# EAGLE design MIDI Signal Contidioner (EAGLE 9.3.0)
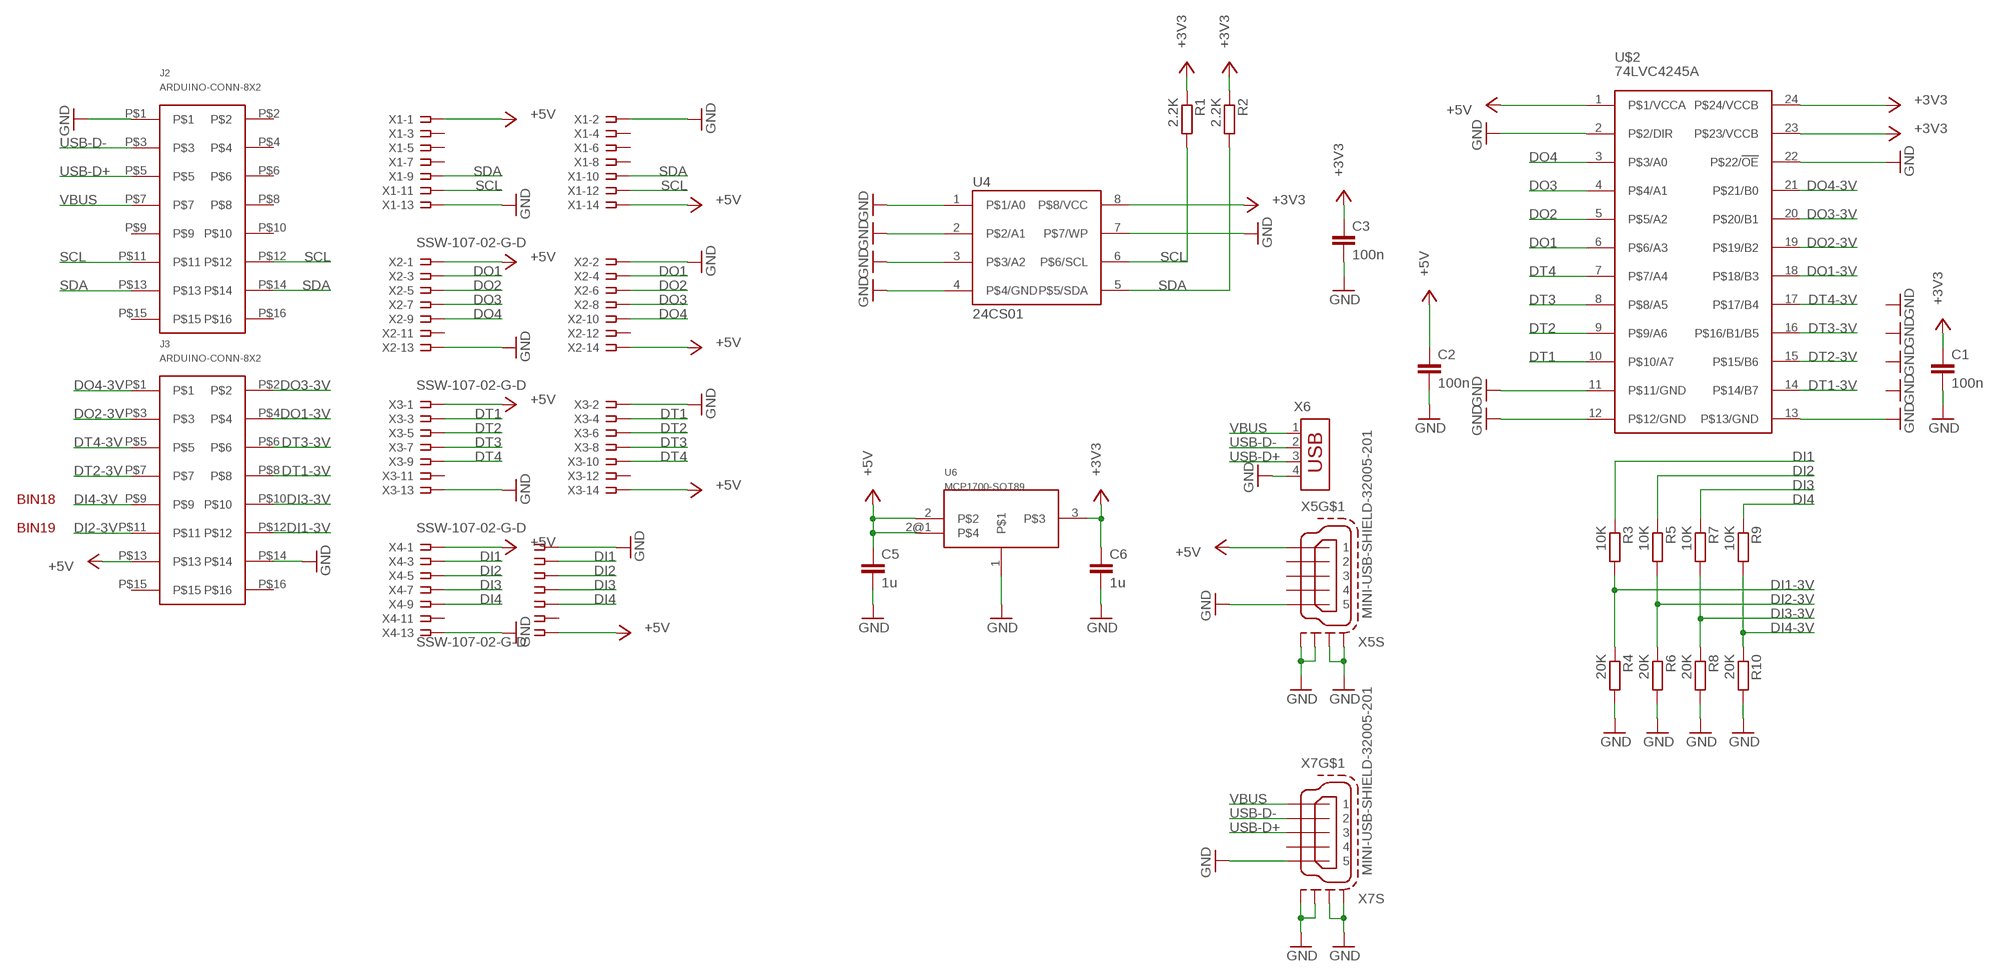
[diagram p0: schematic, sheet 1]

## Parts
C1  100n  C-EUC0805  [C0805]
C2  100n  C-EUC0805  [C0805]
C3  100n  C-EUC0805  [C0805]
C5  1u  C-EUC0805  [C0805]
C6  1u  C-EUC0805  [C0805]
J2  ARDUINO-CONN-8X2  [ARDUINO-CONN-8X2]
J3  ARDUINO-CONN-8X2  [ARDUINO-CONN-8X2]
R1  2.2K  R-EU_R0805W  [R0805W]
R2  2.2K  R-EU_R0805W  [R0805W]
R3  10K  R-EU_R0805W  [R0805W]
R4  20K  R-EU_R0805W  [R0805W]
R5  10K  R-EU_R0805W  [R0805W]
R6  20K  R-EU_R0805W  [R0805W]
R7  10K  R-EU_R0805W  [R0805W]
R8  20K  R-EU_R0805W  [R0805W]
R9  10K  R-EU_R0805W  [R0805W]
R10  20K  R-EU_R0805W  [R0805W]
U4  24CS01  [24CS01-SO8]
U6  MCP1700-SOT89  [MCP1700-SOT89]
U$2  74LVC4245A  [74LVC4245A-SO24]
X1  SSW-107-02-G-D  [SSW-107-02-G-D]
X2  SSW-107-02-G-D  [SSW-107-02-G-D]
X3  SSW-107-02-G-D  [SSW-107-02-G-D]
X4  SSW-107-02-G-D  [SSW-107-02-G-D]
X5  MINI-USB-SHIELD-32005-201  [MINI-USB-32005-201]
X6  USB-787616  [USB]
X7  MINI-USB-SHIELD-32005-201  [MINI-USB-32005-201]

## Nets
+3V3: C1.1 C3.1 C6.1 R1.1 R2.1 U4.8(P$8/VCC) U6.3 U$2.23(P$23/VCCB) U$2.24(P$24/VCCB)
+5V: C2.1 C5.1 J3.P$13 U6.2 U6.2@1 U$2.1(P$1/VCCA) X1.1 X1.14 X2.1 X2.14 X3.1 X3.14 X4.1 X4.14 X5.1
DI1: R3.1 X4.3 X4.4
DI1-3V: J3.P$12 R3.2 R4.1
DI2: R5.1 X4.5 X4.6
DI2-3V: J3.P$11 R5.2 R6.1
DI3: R7.1 X4.7 X4.8
DI3-3V: J3.P$10 R7.2 R8.1
DI4: R9.1 X4.9 X4.10
DI4-3V: J3.P$9 R9.2 R10.1
DO1: U$2.6(P$6/A3) X2.3 X2.4
DO1-3V: J3.P$4 U$2.18(P$18/B3)
DO2: U$2.5(P$5/A2) X2.5 X2.6
DO2-3V: J3.P$3 U$2.19(P$19/B2)
DO3: U$2.4(P$4/A1) X2.7 X2.8
DO3-3V: J3.P$2 U$2.20(P$20/B1)
DO4: U$2.3(P$3/A0) X2.9 X2.10
DO4-3V: J3.P$1 U$2.21(P$21/B0)
DT1: U$2.10(P$10/A7) X3.3 X3.4
DT1-3V: J3.P$8 U$2.14(P$14/B7)
DT2: U$2.9(P$9/A6) X3.5 X3.6
DT2-3V: J3.P$7 U$2.15(P$15/B6)
DT3: U$2.8(P$8/A5) X3.7 X3.8
DT3-3V: J3.P$6 U$2.16(P$16/B1/B5)
DT4: U$2.7(P$7/A4) X3.9 X3.10
DT4-3V: J3.P$5 U$2.17(P$17/B4)
GND: C1.2 C2.2 C3.2 C5.2 C6.2 J2.P$1 J3.P$14 R4.2 R6.2 R8.2 R10.2 U4.1(P$1/A0) U4.2(P$2/A1) U4.3(P$3/A2) U4.4(P$4/GND) U4.7(P$7/WP) U6.1 U$2.2(P$2/DIR) U$2.11(P$11/GND) U$2.12(P$12/GND) U$2.13(P$13/GND) U$2.22(P$22/!OE) X1.2 X1.13 X2.2 X2.13 X3.2 X3.13 X4.2 X4.13 X5.5 X5.M1(S:S1) X5.M2(S:S2) X5.M3(S:S3) X5.M4(S:S4) X6.4 X7.5 X7.M1(S:S1) X7.M2(S:S2) X7.M3(S:S3) X7.M4(S:S4)
SCL: J2.P$11 J2.P$12 R1.2 U4.6(P$6/SCL) X1.11 X1.12
SDA: J2.P$13 J2.P$14 R2.2 U4.5(P$5/SDA) X1.9 X1.10
USB-D+: J2.P$5 X6.3 X7.3
USB-D-: J2.P$3 X6.2 X7.2
VBUS: J2.P$7 X6.1 X7.1
Unconnected: J2.P$2 J2.P$4 J2.P$6 J2.P$8 J2.P$9 J2.P$10 J2.P$15 J2.P$16 J3.P$15 J3.P$16 X1.3 X1.4 X1.5 X1.6 X1.7 X1.8 X2.11 X2.12 X3.11 X3.12 X4.11 X4.12 X5.2 X5.3 X5.4 X7.4

## Notes on the sheet
- BIN18
- BIN19

## Library data of the parts
C1-C3 C5 C6 = rcl:C-EU: CAPACITOR, European symbol; SPICEPREFIX: C
J2 J3 = MIDI router MCU parts:ARDUINO-CONN-8X2
R1-R10 = rcl:R-EU_: RESISTOR, European symbol; SPICEPREFIX: R
U4 = MIDI Signal Conditioner Parts:24CS01
U6 = MIDI router parts:MCP1700-SOT89
U$2 = MIDI router parts:74LVC4245A
X1-X4 = MIDI router parts:SSW-107-02-G: THROUGH-HOLE .025" SQ POST SOCKET Source: Samtec SSW.pdf; MF: Samtec Inc.; MPN: SSW-107-02-G-D; OC_FARNELL: unknown; OC_NEWARK: 11P9431
X5 X7 = MIDI router parts:MINI-USB-SHIELD-: MINI USB-B Conector Source: www.cypressindustries.com; OC_FARNELL: unknown; OC_NEWARK: unknown
X6 = MIDI router parts:USB-787616: AMP connector

## Board
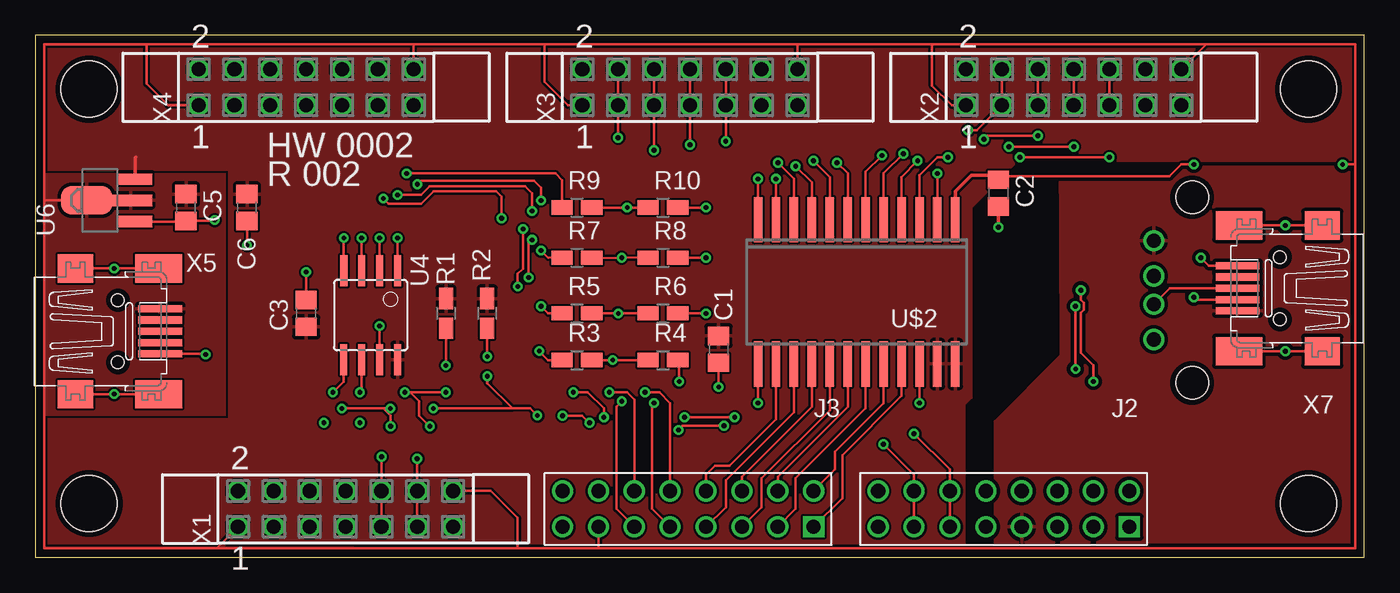
[diagram p1: board, top side]
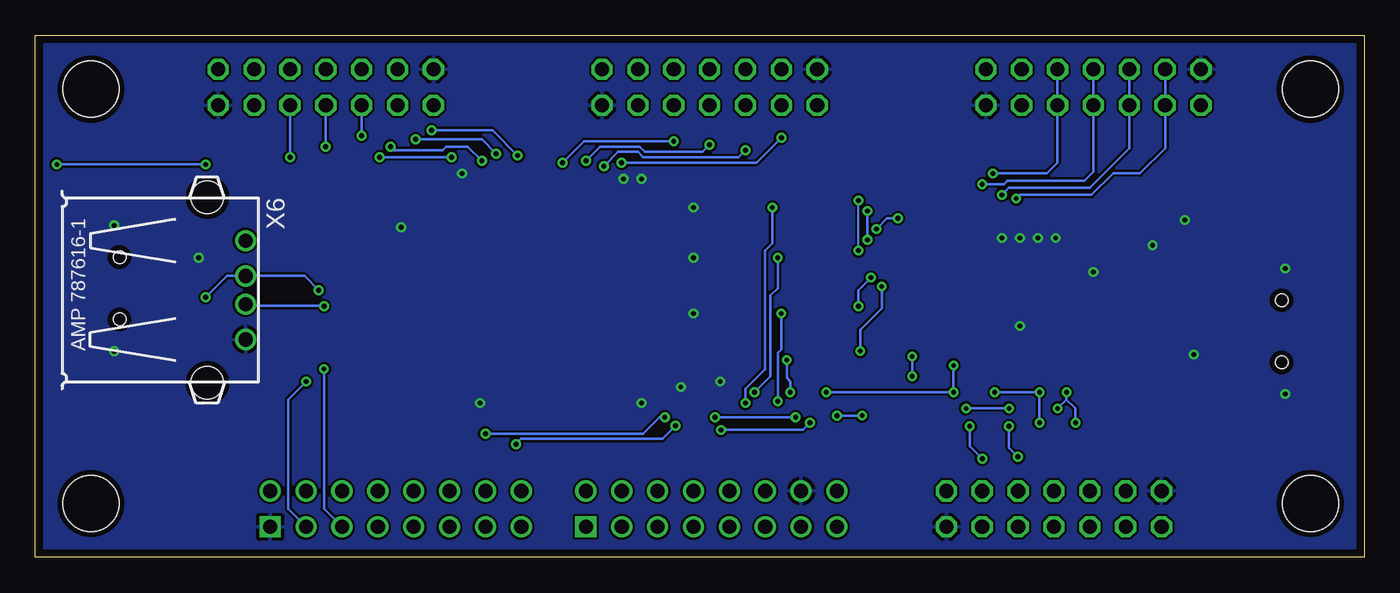
[diagram p2: board, bottom side, seen from below]

Size 94.11 x 36.96 mm. Coordinates in mm from the lower left corner, seen from the top.
Outline: 0,0 94.11,0 94.11,36.96 0,36.96 0,0
Copper layers (1*16): Top 0.0356mm / dielectric 1.5011mm / Bottom 0.0356mm
Design rules "LaenPCBOrder": minimum track width 6mil, minimum drill 13mil, track to track 6mil, track to pad 6mil, pad to pad 6mil, via to via 6mil, smd to smd 6mil, copper to edge 15mil, drill to drill 6mil, minimum pad ring 7mil, minimum via ring 7mil, stop-mask expansion 3mil, vias tented up to drill 0mil, thermal gap 10mil
Holes 3.96 mm at 3.81,33.15 3.81,3.81 90.17,3.81 90.17,33.15

### Footprints (pad centres in the part's own frame; a part is rotated, then mirrored left to right if it is on the bottom)
C0805 = smd 1.3 x 1.5: 1 -0.95,0; 2 0.95,0
ARDUINO-CONN-8X2 = drill 1 square: P$1 0,0 | drill 1: P$2 0,-2.54; P$3 2.54,0; P$4 2.54,-2.54; P$5 5.08,0; P$6 5.08,-2.54; P$7 7.62,0; P$8 7.62,-2.54; P$9 10.16,0; P$10 10.16,-2.54; P$11 12.7,0; P$12 12.7,-2.54; P$13 15.24,0; P$14 15.24,-2.54; P$15 17.78,0; P$16 17.78,-2.54
R0805W = smd 1.5 x 1: 1 -1.052,0; 2 1.052,0
24CS01-SO8 = smd 0.5 x 2.2: 1 -1.905,-3.154; 2 -0.645,-3.154; 3 0.625,-3.154; 4 1.895,-3.154; 5 1.905,3.154; 6 0.635,3.154; 7 -0.635,3.154; 8 -1.905,3.154
MCP1700-SOT89 = smd 0.8 x 2.4: 1 -1.499,-2.5; 3 1.499,-2.5 | smd 0.8 x 3: 2 0,-2.2 | smd 2.032 x 3.65: 2@1 0,0.94
74LVC4245A-SO24 = smd 0.6 x 3.2: 1 -8.255,-5.1; 2 -6.985,-5.1; 3 -5.715,-5.1; 4 -4.445,-5.1; 5 -3.175,-5.1; 6 -1.905,-5.1; 7 -0.635,-5.1; 8 0.635,-5.1; 9 1.905,-5.1; 10 3.175,-5.1; 11 4.445,-5.1; 12 5.715,-5.1; 13 5.715,5.1; 14 4.445,5.1; 15 3.175,5.1; 16 1.905,5.1; 17 0.635,5.1; 18 -0.635,5.1; 19 -1.905,5.1; 20 -3.175,5.1; 21 -4.445,5.1; 22 -5.715,5.1; 23 -6.985,5.1; 24 -8.255,5.1
SSW-107-02-G-D = drill 1 pad 1.5 octagon: 1 -7.62,-1.27; 2 -7.62,1.27; 3 -5.08,-1.27; 4 -5.08,1.27; 5 -2.54,-1.27; 6 -2.54,1.27; 7 0,-1.27; 8 0,1.27; 9 2.54,-1.27; 10 2.54,1.27; 11 5.08,-1.27; 12 5.08,1.27; 13 7.62,-1.27; 14 7.62,1.27
MINI-USB-32005-201 = smd 3.1 x 0.5: 1 3,1.6; 2 3,0.8; 3 3,0; 4 3,-0.8; 5 3,-1.6 | smd 2.5 x 2: M1 -3,-4.45; M2 -3,4.45 | smd 3.3 x 2: M3 2.9,4.45; M4 2.9,-4.45 | hole 0.9: 0,2.2; 0,-2.2
USB = drill 1: 1 -3.5,12.99; 2 -1,12.99; 3 1,12.99; 4 3.5,12.99 | hole 2.3: -6.57,10.28; 6.57,10.28

### Placement (x,y rotation side)
C1  48.39,14.73 270 top
C2  68.2,25.78 270 top
C3  19.18,17.27 90 top
C5  10.67,24.77 270 top
C6  14.99,24.77 270 top
J2  77.47,2.16 180 top
J3  55.12,2.16 180 top
R1  29.08,17.27 270 top
R2  32,17.27 270 top
R3  38.35,13.97 0 top
R4  44.45,13.97 0 top
R5  38.35,17.27 0 top
R6  44.45,17.27 0 top
R7  38.35,21.21 0 top
R8  44.45,21.21 0 top
R9  38.35,24.77 0 top
R10  44.45,24.77 0 top
U4  23.75,17.14 180 top
U6  4.57,25.27 90 top
U$2  56.9,18.8 180 top
X1  21.97,3.43 0 top
X2  73.53,33.27 0 top
X3  46.35,33.27 0 top
X4  19.18,33.27 0 top
X5  5.84,16 0 top
X6  92.2,18.92 270 bottom
X7  88.14,19.05 180 top

### Tracks (layer width: path | path; a pad name or v marks a point on that pad's centre or on a via)
+3V3
  Top 0.254: U6.3 7.07,28.28 7.11,28.32
  pour Top: 65.79,0.64 65.79,10.79 66.29,11.3 66.29,24.77 69.6,28.07 93.47,28.07 93.47,36.32 0.64,36.32 0.64,27.43 13.72,27.43 13.72,9.78 0.64,9.78 0.64,0.64
+5V  (via drill 0.33)
  Top 0.178: J3.P$13 39.88,0.64 | 12.83,0.64 0.64,0.64 0.64,25.27 | 0.64,25.27 0.64,36.32 7.87,36.32 | 53.98,36.32 63.5,36.32 | 63.5,36.32 82.93,36.32 | 93.47,27.81 93.47,36.32 82.93,36.32 | 93.47,27.81 93.47,0.64 39.88,0.64 | U6.2@1 0.64,25.27 | X3.14 53.98,36.32 | 7.87,36.32 7.87,33.53 9.4,32 X4.1 | X1.1 12.83,0.64 | X2.14 82.93,36.32 | C2.1 68.23,26.76 68.45,26.98 80.33,26.98 81.15,27.81 v82.04,27.81 | v92.58,27.81 93.47,27.81 | X3.1 37.72,32 36.07,33.66 36.07,36.32 | 36.07,36.32 26.8,36.32 | 26.8,36.32 7.87,36.32 | 36.07,36.32 53.98,36.32 | X4.14 26.8,36.32 | X2.1 64.9,32 63.5,33.4 63.5,36.32 | 39.88,0.64 34.16,0.64 | 34.16,0.64 12.83,0.64 | X1.14 32.26,4.7 34.16,2.79 34.16,0.64
  Top 0.254: U$2.1 65.15,25.91 66.29,27.05 67.94,27.05 68.23,26.76
  Bottom 0.178: v92.58,27.81 v82.04,27.81
  pour Top (rank 2): 0.64,36.32 22.48,36.32 22.48,0.64 0.64,0.64
DI1  (via drill 0.33)
  Top 0.178: v24.64,25.4 25.02,25.02 27.3,25.02 28.19,25.91 32.64,25.91 33.02,25.53 v33.02,24 | R3.1 36.32,13.97 v35.69,14.61 | v34.16,19.18 34.16,20.07 34.54,20.45 v34.54,23.24
  Bottom 0.178: v24.64,25.4 24.38,25.65 19.3,25.65 17.78,27.18 15.88,27.18 14.1,28.96 X4.3 X4.4 | v35.69,14.61 35.69,16.13 34.16,17.65 v34.16,19.18 | v34.54,23.24 33.78,24 v33.02,24
DI1-3V  (via drill 0.33)
  Top 0.178: R3.2 v40.89,13.97 R4.1 | v40.64,11.68 41.91,11.68 42.42,11.18 J3.P$12
  Bottom 0.178: v40.64,11.68 40.64,12.45 40.89,12.7 v40.89,13.97
DI2  (via drill 0.33)
  Top 0.178: v25.65,25.65 27.3,25.65 27.94,26.29 34.67,26.29 35.18,25.78 v35.18,24.51 | R5.1 36.32,17.27 v35.81,17.78 | v34.92,19.81 34.92,22.23 v35.18,22.48
  Bottom 0.178: v25.65,25.65 25.15,26.16 19.43,26.16 16.64,28.96 X4.5 X4.6 | v35.81,17.78 35.81,18.92 v34.92,19.81 | v35.18,22.48 v35.18,24.51
DI2-3V  (via drill 0.33)
  Top 0.178: R5.2 v41.27,17.27 R6.1 | J3.P$11 41.15,3.43 41.15,10.67 v41.53,11.05
  Bottom 0.178: v41.53,11.05 41.53,14.48 41.27,14.73 v41.27,17.27
DI3  (via drill 0.33)
  Top 0.152: R7.1 36.32,21.21 v35.81,21.72
  Top 0.178: v27.05,26.42 27.3,26.67 35.31,26.67 35.81,26.16 v35.81,25.27
  Bottom 0.152: v35.81,21.72 v35.81,25.27
  Bottom 0.178: v27.05,26.42 25.53,26.42 25.27,26.67 19.81,26.67 19.18,27.3 X4.7 X4.8
DI3-3V  (via drill 0.33)
  Top 0.152: R7.2 v41.53,21.21 R8.1
  Top 0.178: v43.18,11.68 44.2,11.68 44.96,10.92 J3.P$10
  Bottom 0.178: v43.18,11.68 42.04,12.83 42.04,18.54 41.53,19.05 v41.53,21.21
DI4  (via drill 0.33)
  Top 0.178: v26.29,27.18 36.83,27.18 37.3,26.71 R9.1
  Bottom 0.178: v26.29,27.18 22.48,27.18 21.72,27.94 X4.9 X4.10
DI4-3V  (via drill 0.33)
  Top 0.178: R9.2 v41.91,24.77 R10.1 | J3.P$9 43.69,3.43 43.69,10.79 v43.81,10.92
  Bottom 0.178: v43.81,10.92 43.81,11.94 42.42,13.34 42.42,21.72 41.91,22.23 v41.91,24.77
DO1  (via drill 0.35)
  Top 0.178: X2.4 X2.3 66.67,30.23 v66.04,30.23 | U$2.6 58.8,27.3 v59.94,28.45
  Bottom 0.178: v59.94,28.45 61.72,30.23 v66.04,30.23
DO1-3V
  Top 0.178: J3.P$4 52.58,5.71 57.53,10.67 U$2.18
DO2  (via drill 0.35)
  Top 0.178: X2.6 X2.5 | U$2.5 60.07,27.18 v61.47,28.57 | v67.18,29.59 67.44,29.84 v70.99,29.84
  Bottom 0.178: v61.47,28.57 62.48,29.59 v67.18,29.59 | v70.99,29.84 X2.5
DO2-3V
  Top 0.178: J3.P$3 53.85,3.43 53.85,5.59 58.8,10.54 U$2.19
DO3  (via drill 0.35)
  Top 0.178: X2.8 X2.7 | U$2.4 61.34,26.92 v62.48,28.07 | v68.96,29.08 v73.53,29.08
  Bottom 0.178: v62.48,28.07 63.5,29.08 65.02,29.08 65.28,28.83 68.71,28.83 v68.96,29.08 | v73.53,29.08 X2.7
DO3-3V
  Top 0.178: J3.P$2 56.64,6.22 56.64,7.49 60.07,10.92 U$2.20
DO4  (via drill 0.35)
  Top 0.178: X2.10 X2.9 | U$2.3 62.61,27.05 63.88,28.32 v64.64,28.32 | v69.72,28.32 v76.07,28.32
  Bottom 0.178: v64.64,28.32 v69.72,28.32 | v76.07,28.32 X2.9
DO4-3V
  Top 0.178: J3.P$1 57.15,4.19 57.15,7.24 61.34,11.43 U$2.21
DT1  (via drill 0.35)
  Top 0.178: X3.4 X3.3 v41.27,29.72 | U$2.10 53.72,26.8 v52.58,27.94
  Bottom 0.178: v52.58,27.94 43.05,27.94 v41.27,29.72
DT1-3V
  Top 0.178: J3.P$8 47.5,5.84 48.13,6.48 49.15,6.48 52.45,9.78 U$2.14
DT2  (via drill 0.35)
  Top 0.178: X3.6 X3.5 v43.81,28.83 | U$2.9 54.99,26.54 v53.85,27.69
  Bottom 0.178: v53.85,27.69 52.83,28.7 51.44,28.7 51.05,28.32 44.32,28.32 v43.81,28.83
DT2-3V
  Top 0.178: J3.P$7 48.9,3.56 48.9,5.46 53.72,10.29 U$2.15
DT3  (via drill 0.35)
  Top 0.178: X3.8 X3.7 v46.35,29.21 | U$2.8 56.26,26.92 v55.12,28.07
  Bottom 0.178: v55.12,28.07 54.1,29.08 51.31,29.08 50.93,28.7 46.86,28.7 v46.35,29.21
DT3-3V
  Top 0.178: J3.P$6 50.04,5.71 54.99,10.67 U$2.16
DT4  (via drill 0.35)
  Top 0.178: X3.10 X3.9 v48.9,29.46 | U$2.7 57.53,27.18 v56.77,27.94
  Bottom 0.178: v56.77,27.94 55.24,29.46 v48.9,29.46
DT4-3V
  Top 0.178: J3.P$5 51.44,3.56 51.44,5.59 56.26,10.41 U$2.17
GND  (via drill 0.33, 0.35)
  Top 0.152: R4.2 45.59,13.88
  Top 0.178: X5.M1 v5.58,11.55 v5.59,11.56 X5.M4 | X5.M2 v5.58,20.45 | v5.58,20.45 v5.59,20.45 | X5.M3 v5.58,20.45 | U6.1 10.63,23.77 C5.2 12.64,23.82 v12.7,23.88 | X5.5 12.01,14.4 v12.06,14.35 | C3.2 v19.18,20.19 | U4.7 v24.38,16.38 | C6.2 v14.99,22.1 | 45.59,13.88 v45.59,12.45 | C1.2 v48.39,12.06 | R6.2 v47.5,17.27 | R8.2 v47.5,21.21 | R10.2 v47.5,24.77 | U$2.12 v51.18,26.8 | U$2.11 v52.45,26.8 | U$2.2 v63.88,27.18 | U4.4 v21.84,22.61 | U4.3 23.12,22.6 v23.11,22.61 | U4.2 24.39,22.6 v24.38,22.61 | U4.1 v25.65,22.61 | U$2.13 v51.18,10.92 | U$2.22 v62.61,10.92 | X7.M3 v88.51,14.6 v88.52,14.61 v88.52,14.6 X7.M2 | X7.M4 v88.51,23.5 v88.52,23.5 X7.M1 | X7.5 83.11,20.65 v82.55,21.21
  Top 0.254: C2.2 v68.2,23.37
  pour Bottom: 0.64,36.32 93.47,36.32 93.47,0.64 0.64,0.64
SCL  (via drill 0.33, 0.35)
  Top 0.178: U4.6 23.11,11.81 v22.99,11.68 | v29.08,11.68 v26.16,11.68 26.54,11.68 27.18,11.05 27.18,10.03 v27.94,9.27 | R1.2 v29.08,13.59 | v38.1,11.68 39.12,11.68 40.26,10.54 v40.26,9.91 | J2.P$11 J2.P$12 64.77,6.22 v62.23,8.76 | v49.53,9.91 v45.97,9.91 | X1.11 X1.12 v27.05,6.99
  Bottom 0.178: v22.99,9.53 v22.99,11.68 v26.16,11.68 | v38.1,11.68 v29.08,11.68 v29.08,13.59 | v62.23,8.76 51.05,8.76 49.91,9.91 v49.53,9.91 | v45.97,9.91 v40.26,9.91 | v27.05,6.99 27.94,7.87 v27.94,9.27
SDA  (via drill 0.33, 0.35)
  Top 0.178: U4.5 21.84,12.45 v21.08,11.68 | v21.72,10.54 24.64,10.54 | 24.64,10.54 v25.15,10.54 | v32,14.22 R2.2 | 33.78,10.54 32,12.32 v32,12.83 | v28.19,10.54 33.78,10.54 | v35.56,10.03 35.05,10.54 33.78,10.54 | J2.P$13 J2.P$14 62.23,5.84 v60.07,8 | v48.77,9.31 45.85,9.31 v45.55,9.02 | v39.24,9.53 38.73,10.03 v37.34,10.03 | X1.9 X1.10 v24.51,7.11 | v25.15,9.27 25.15,10.03 24.64,10.54
  Bottom 0.178: 21.08,11.18 v21.72,10.54 | v25.15,10.54 v28.19,10.54 | v32,12.83 v32,14.22 | v21.08,11.68 21.08,11.18 | 21.08,11.18 20.45,10.54 v20.45,9.53 | v35.56,10.03 v37.34,10.03 | v60.07,8 59.69,8.38 49.7,8.38 v48.77,9.31 | v45.55,9.02 39.75,9.02 v39.24,9.53 | v24.51,7.11 25.15,7.75 v25.15,9.27
USB-D+  (via drill 0.33, 0.35)
  Top 0.178: v73.66,17.78 v73.66,13.34 | X7.3 80.34,19.05 X6.3
  Bottom 0.178: v73.66,17.78 73.68,17.8 79.08,17.8 X6.3 | J2.P$5 73.66,3.43 v73.66,13.34
USB-D-  (via drill 0.33, 0.35)
  Top 0.178: v74.93,12.45 74.93,13.59 74.04,14.48 74.04,17.32 74.25,17.53 74.25,18.03 74.04,18.24 v74.04,18.92 | X7.2 82.21,18.25 v82.04,18.41
  Bottom 0.178: J2.P$3 76.2,3.43 76.2,11.18 v74.93,12.45 | v74.04,18.92 75.04,19.92 X6.2 80.53,19.92 v82.04,18.41
VBUS
  pour Top (isolate 0.254, rank 2): 93.47,0.64 93.47,36.32 72.52,36.32 72.64,15.11 72.64,14.35 67.94,9.65 67.94,0.76 67.82,0.64 75.17,0.64 75.18,0.65 75.2,0.64

### Text on the board
tNames: HW 0002 | R 002
tDocu: 3. verify board-to-board connectors, etc. on checklist | V+ | POWER | D- | D+ | USB | V-